# EasyEDA schematic RC_MOTOR.json
TITLE: Sheet_1; REV: 1.0; Date: 2023-11-19; Sheet: 1/1; Drawn By: yousef.uwk408; Company: Your Company
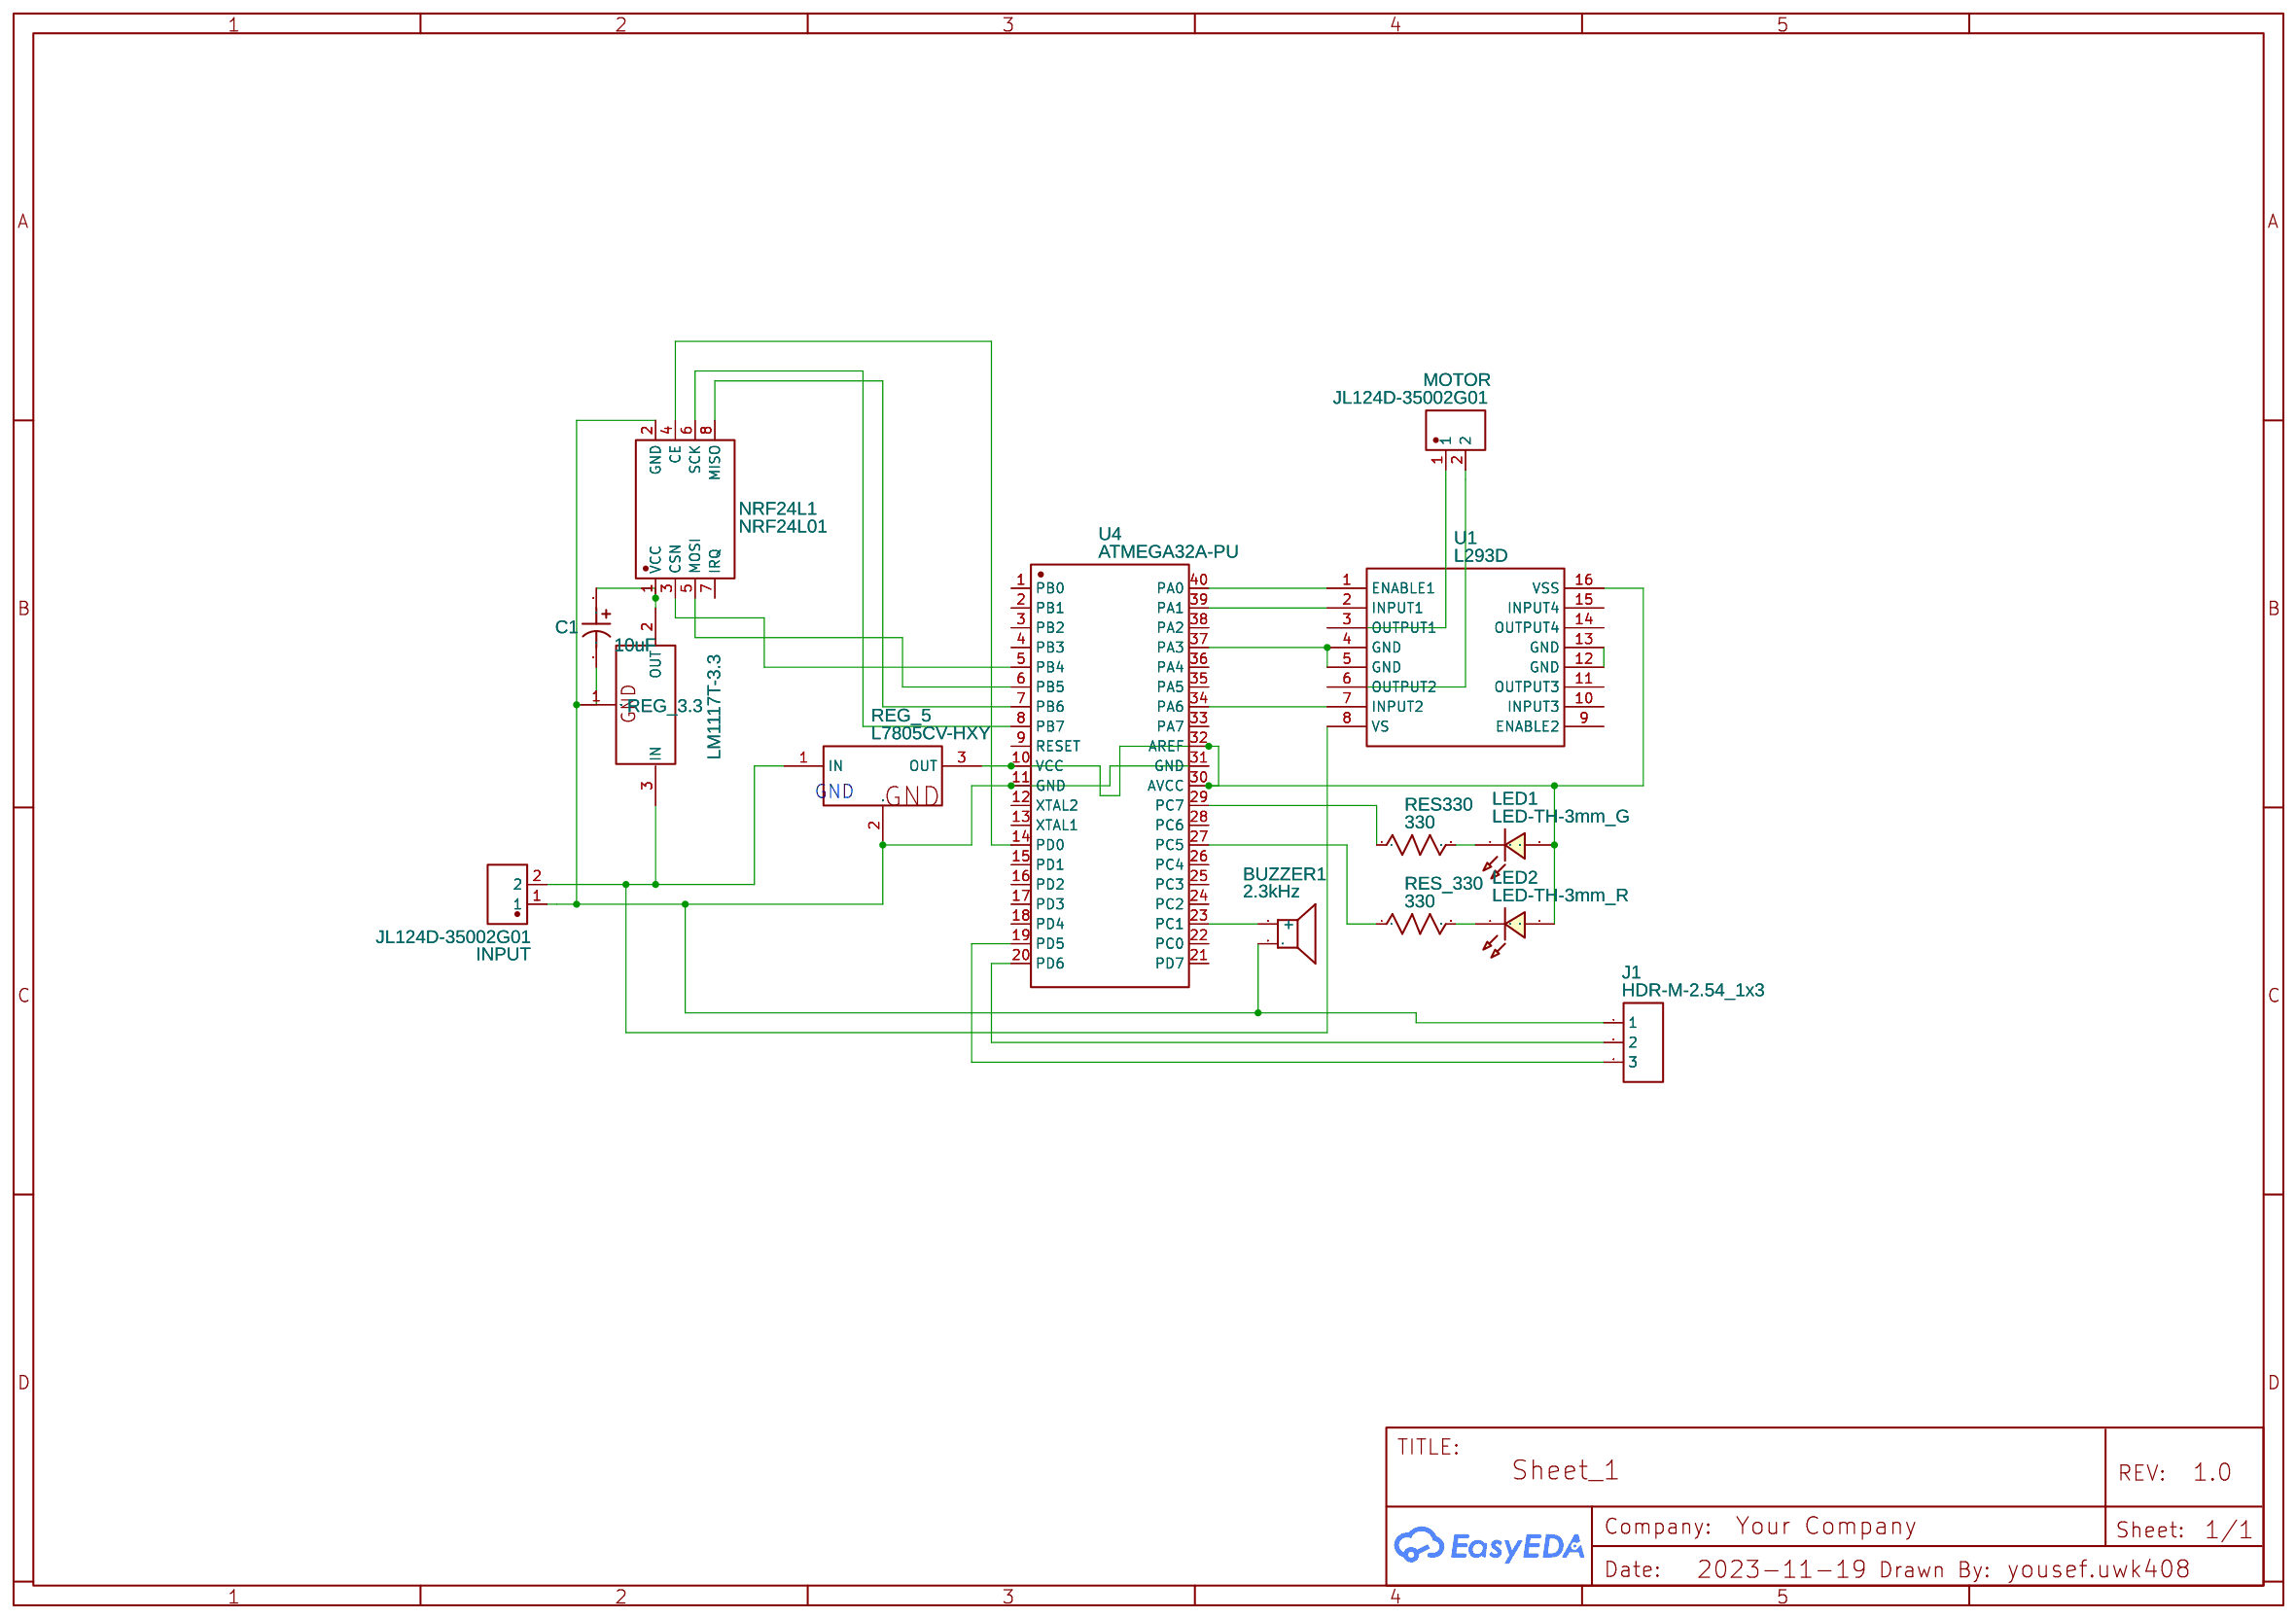
[diagram p0: schematic sheet]

## Parts
BUZZER1  2.3kHz  [BUZ-TH_BD12.0-P7.60-D0.6-FD]
C1  10uF  [CAP-TH_BD5.0-P2.00-D0.5-FD-1]
INPUT  JL124D-35002G01  [CONN-TH_2P-P3.50_JL124D-35002G01]
J1  HDR-M-2.54_1x3  [HDR-M-2.54_1X3]
LED1  LED-TH-3mm_G  [LED-TH_BD3.0_GREEN]
LED2  LED-TH-3mm_R  [LED-TH_BD3.0_RED]
MOTOR  JL124D-35002G01  [CONN-TH_2P-P3.50_JL124D-35002G01]
NRF24L1  NRF24L01  [WIRELM-SMD_NRF24L01]
REG_3  LM1117T-3.3  [TO-220-3_L10.0-W4.5-P2.54-L]  (section 3)
REG_5  L7805CV-HXY  [TO-220-3_L10.0-W4.5-P2.54-L]
RES330  330  [R_AXIAL-0.3]
RES_330  330  [R_AXIAL-0.3]
U1  L293D  [DIP-16_L20.0-W6.4-P2.54-LS7.6-BL]
U4  ATMEGA32A-PU  [DIP-40_L52.3-W13.9-P2.54-LS15.2-BL]

## Library data of the parts
BUZZER1 = TMB12A05: Supplier: LCSC; Manufacturer: 华能; Supplier Part: C96093; JLCPCB Part Class: Extended Part; link: https://lcsc.com/eda_search?q=C96093&%26type=1&ref=editor
C1 = EGH1HM100D11OT: Contributor: lcsc; Supplier: LCSC; Supplier Part: C724632; Manufacturer: AISHI(艾华集团); JLCPCB Part Class: Extended Part; link: https://lcsc.com/eda_search?q=C724632&%26type=1&ref=editor
INPUT MOTOR = JL124D-35002G01: Contributor: LCSC; Supplier: LCSC; Supplier Part: C415432; Manufacturer: JILN(锦凌); JLCPCB Part Class: Extended Part; link: https://lcsc.com/eda_search?q=C415432&%26type=1&ref=editor
J1 = HDR-M-2.54_1x3: Supplier Part: C180248; Supplier: LCSC; Contributor: LCEDA_Lib
LED1 = LED-TH-3mm_G: Manufacturer: EVERLIGHT(台湾亿光); Manufacturer Part: 204-10SYGD/S530-E3; Supplier Part: C85161; Contributor: LCEDA_Lib
LED2 = LED-TH-3mm_R: Manufacturer: EVERLIGHT(台湾亿光); Manufacturer Part: 204-10SDRD/S530-A3-L; Supplier Part: C84774; Supplier: LCSC; Contributor: LCEDA_Lib
NRF24L1 = NRF24L01: Supplier: LCSC; Manufacturer: Ai-Thinker(安信可); Manufacturer Part: NF-04; Supplier Part: C90751; JLCPCB Part Class: Extended Part; link: https://lcsc.com/eda_search?q=C90751&%26type=1&ref=editor
REG_3 = LM1117T-3.3: Contributor: LCSC; Supplier: LCSC; Supplier Part: C498321; Manufacturer: HGSEMI; JLCPCB Part Class: Extended Part; link: https://lcsc.com/eda_search?q=C498321&%26type=1&ref=editor
REG_5 = L7805CV-HXY: Contributor: lcsc; Supplier: LCSC; Supplier Part: C7469132; Manufacturer: HXY MOSFET(华轩阳电子); link: https://lcsc.com/eda_search?q=C7469132&%26type=1&ref=editor
RES330 RES_330 = R_AXIAL-0.3_US: Contributor: LCEDA_Lib
U1 = L293D: Contributor: pitreluc; Supplier: LCSC; Manufacturer: ST(意法半导体); Supplier Part: C12340; JLCPCB Part Class: Extended Part; link: https://lcsc.com/eda_search?q=C12340&%26type=1&ref=editor
U4 = ATMEGA32A-PU: Supplier: LCSC; Manufacturer: MICROCHIP(美国微芯); Supplier Part: C12703; JLCPCB Part Class: Extended Part; link: https://lcsc.com/eda_search?q=C12703&%26type=1&ref=editor

## Nets
Net-(BUZZER1-1): BUZZER1.1(+) U4.23(PC1)
Net-(BUZZER1-2): BUZZER1.2 C1.2 INPUT.1 J1.1 NRF24L1.2(GND) REG_3.1(GND) REG_5.2(GND) U4.11(GND) U4.31(GND)
Net-(C1-1): C1.1 NRF24L1.1(VCC) REG_3.2(OUT)
Net-(INPUT-2): INPUT.2 REG_3.3(IN) REG_5.1(IN) U1.8(VS)
Net-(J1-2): J1.2 U4.20(PD6)
Net-(J1-3): J1.3 U4.19(PD5)
Net-(LED1-1): LED1.1 LED2.1 REG_5.3(OUT) U1.16(VSS) U4.10(VCC) U4.30(AVCC) U4.32(AREF)
Net-(LED1-2): LED1.2 RES330.2
Net-(LED2-2): LED2.2 RES_330.2
Net-(MOTOR-1): MOTOR.1 U1.3(OUTPUT1)
Net-(MOTOR-2): MOTOR.2 U1.6(OUTPUT2)
Net-(NRF24L1-3): NRF24L1.3(CSN) U4.5(PB4)
Net-(NRF24L1-4): NRF24L1.4(CE) U4.14(PD0)
Net-(NRF24L1-5): NRF24L1.5(MOSI) U4.6(PB5)
Net-(NRF24L1-6): NRF24L1.6(SCK) U4.8(PB7)
Net-(NRF24L1-8): NRF24L1.8(MISO) U4.7(PB6)
Net-(RES330-1): RES330.1 U4.29(PC7)
Net-(RES_330-1): RES_330.1 U4.27(PC5)
Net-(U1-1): U1.1(ENABLE1) U4.40(PA0)
Net-(U1-2): U1.2(INPUT1) U4.39(PA1)
Net-(U1-4): U1.4(GND) U1.5(GND) U4.37(PA3)
Net-(U1-7): U1.7(INPUT2) U4.34(PA6)
Net-(U1-12): U1.12(GND) U1.13(GND)

Not connected (* = marked no-connect by the designer): NRF24L1 7(IRQ); U1 9(ENABLE2) 10(INPUT3) 11(OUTPUT3) 14(OUTPUT4) 15(INPUT4); U4 1(PB0) 2(PB1) 3(PB2) 4(PB3) 9(RESET) 12(XTAL2) 13(XTAL1) 15(PD1) 16(PD2) 17(PD3) 18(PD4) 21(PD7) 22(PC0) 24(PC2) 25(PC3) 26(PC4) 28(PC6) 33(PA7) 35(PA5) 36(PA4) 38(PA2)

## Notes on the sheet
- GND
